# Altium project BLDC Gate Driver Breakout.PrjPcb
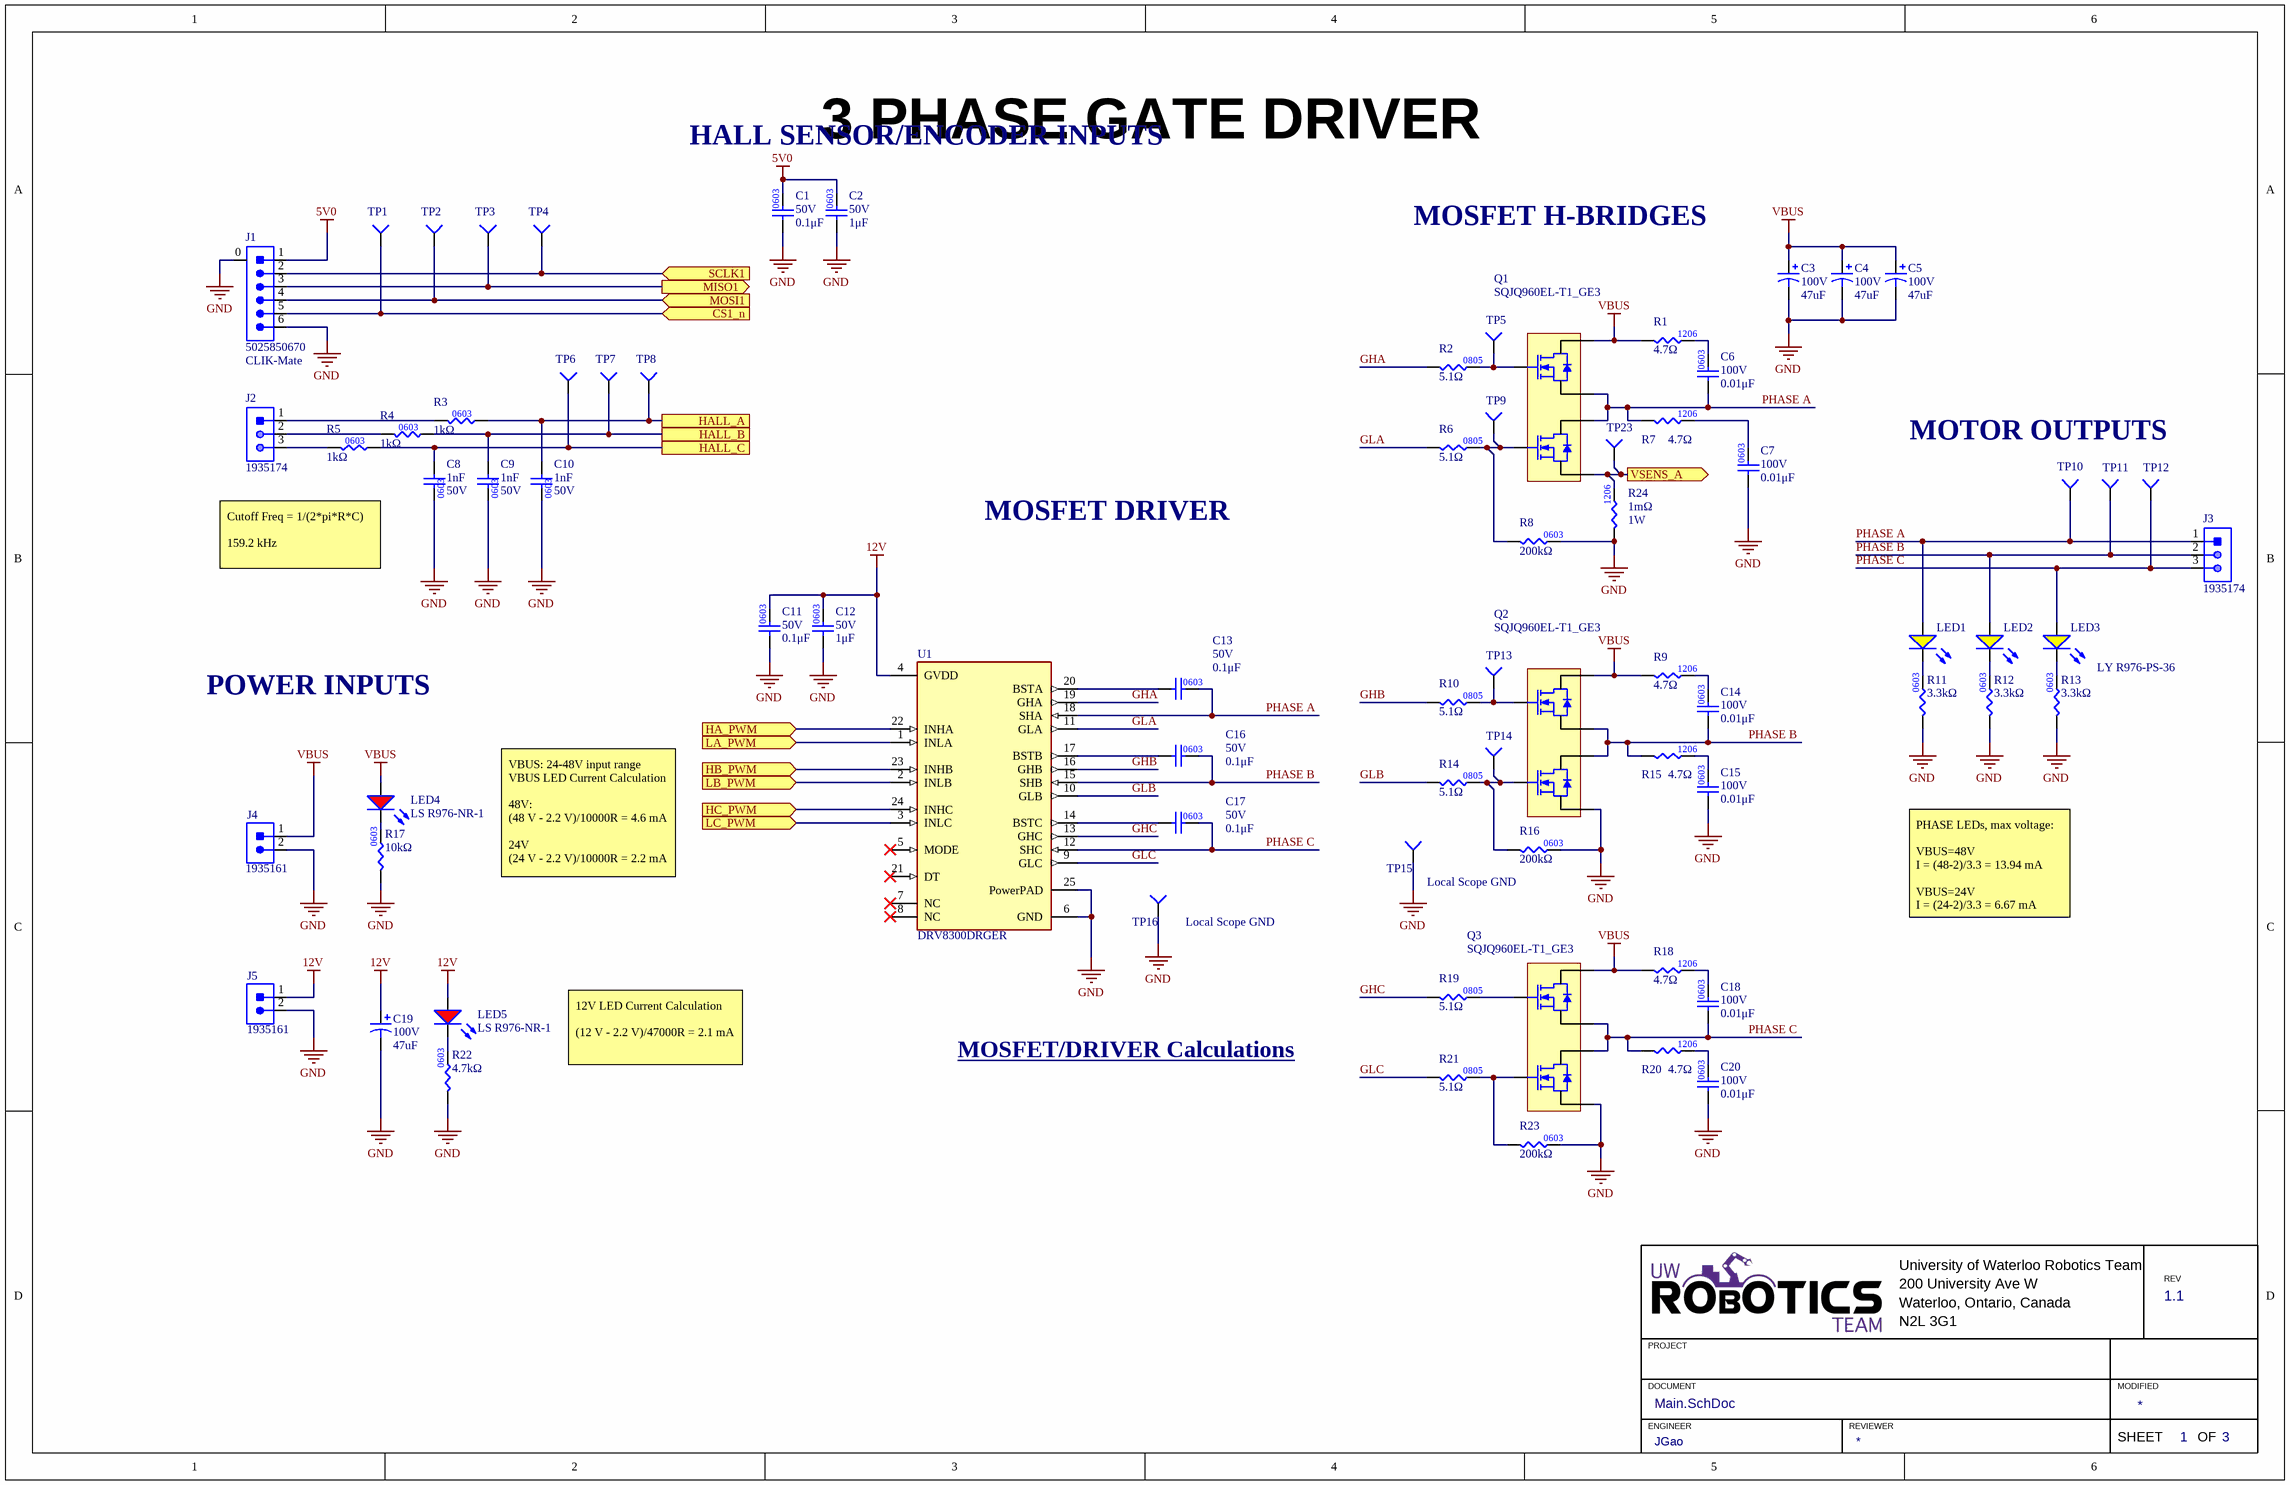
[diagram p0: Main.SchDoc]
3 sheets, 90 parts. Net scope: flat (ports and power ports of the same name join across sheets).
Board file: BLDC Gate Driver Breakout.PcbDoc
Sheets:
  Main.SchDoc
  MCU.SchDoc
  SENSE_AMP.SchDoc

## Sheet Main.SchDoc: 3 PHASE GATE DRIVER
size 431 x 279 mm; Date: 8/30/2021; Engineer: JGao; Revision: 1.1; SheetNumber: 1; SheetTotal: 3

### Parts
C1  value 0.1μF  Voltage Rating: 50V  [CAP0603]  (hidden comment: CAP_0.1uF_50V_0603)
C2  value 1μF  Voltage Rating: 50V  [CAP0603]  (hidden comment: CAP_1uF_50V_0603)
C3  Voltage Rating: 100V  Capacitance: 47uF  [RADIAL_CORNELL_D]  (hidden comment: CAP_47uF_100V_ALUM)
C4  Voltage Rating: 100V  Capacitance: 47uF  [RADIAL_CORNELL_D]  (hidden comment: CAP_47uF_100V_ALUM)
C5  Voltage Rating: 100V  Capacitance: 47uF  [RADIAL_CORNELL_D]  (hidden comment: CAP_47uF_100V_ALUM)
C6  value 0.01μF  Voltage Rating: 100V  [CAP0603]  (hidden comment: CAP_0.01uF_100V_0603)
C7  value 0.01μF  Voltage Rating: 100V  [CAP0603]  (hidden comment: CAP_0.01uF_100V_0603)
C8  value 1nF  Voltage Rating: 50V  [cap0603]  (hidden comment: CAP_1nF_50V_0603_XR7)
C9  value 1nF  Voltage Rating: 50V  [cap0603]  (hidden comment: CAP_1nF_50V_0603_XR7)
C10  value 1nF  Voltage Rating: 50V  [cap0603]  (hidden comment: CAP_1nF_50V_0603_XR7)
C11  value 0.1μF  Voltage Rating: 50V  [CAP0603]  (hidden comment: CAP_0.1uF_50V_0603)
C12  value 1μF  Voltage Rating: 50V  [CAP0603]  (hidden comment: CAP_1uF_50V_0603)
C13  value 0.1μF  Voltage Rating: 50V  [CAP0603]  (hidden comment: CAP_0.1uF_50V_0603)
C14  value 0.01μF  Voltage Rating: 100V  [CAP0603]  (hidden comment: CAP_0.01uF_100V_0603)
C15  value 0.01μF  Voltage Rating: 100V  [CAP0603]  (hidden comment: CAP_0.01uF_100V_0603)
C16  value 0.1μF  Voltage Rating: 50V  [CAP0603]  (hidden comment: CAP_0.1uF_50V_0603)
C17  value 0.1μF  Voltage Rating: 50V  [CAP0603]  (hidden comment: CAP_0.1uF_50V_0603)
C18  value 0.01μF  Voltage Rating: 100V  [CAP0603]  (hidden comment: CAP_0.01uF_100V_0603)
C19  Voltage Rating: 100V  Capacitance: 47uF  [RADIAL_CORNELL_D]  (hidden comment: CAP_47uF_100V_ALUM)
C20  value 0.01μF  Voltage Rating: 100V  [CAP0603]  (hidden comment: CAP_0.01uF_100V_0603)
J1  Manufacturer Part Number 1: 5025850670  Family: CLIK-Mate  [MOLEX-5025850670]  (hidden comment: CON_6M_SM_RA_1.5mm)
J2  CON_3POS_SCREW_TERM  [1935174]  (value not drawn)
J3  CON_3POS_SCREW_TERM  [1935174]  (value not drawn)
J4  CON_2POS_SCREW_TERM  [1935161]  (value not drawn)
J5  CON_2POS_SCREW_TERM  [1935161]  (value not drawn)
LED1  Manufacturer Part Number 1: LY R976-PS-36  [LED_0805_YELLOW]  (hidden comment: LED_YELLOW)
LED2  LED_YELLOW  [LED_0805_YELLOW]  (value not drawn)
LED3  LED_YELLOW  [LED_0805_YELLOW]  (value not drawn)
LED4  Manufacturer Part Number 1: LS R976-NR-1  [LED_0805_RED]  (hidden comment: LED_RED)
LED5  Manufacturer Part Number 1: LS R976-NR-1  [LED_0805_RED]  (hidden comment: LED_RED)
Q1  Manufacturer Part Number: SQJQ960EL-T1_GE3  [PowerPAK 8 x 8 Dual]  (hidden comment: NMOS_2CH_60V_63A)
Q2  Manufacturer Part Number: SQJQ960EL-T1_GE3  [PowerPAK 8 x 8 Dual]  (hidden comment: NMOS_2CH_60V_63A)
Q3  Manufacturer Part Number: SQJQ960EL-T1_GE3  [PowerPAK 8 x 8 Dual]  (hidden comment: NMOS_2CH_60V_63A)
R1  value 4.7Ω  [RES1206]  (hidden comment: RES_4.7Ω_1206_1%)
R2  value 5.1Ω  [RES0805]  (hidden comment: RES_5.1Ω_0805_5%)
R3  value 1kΩ  [RES0603]  (hidden comment: RES_1kΩ_0603_5%)
R4  value 1kΩ  [RES0603]  (hidden comment: RES_1kΩ_0603_5%)
R5  value 1kΩ  [RES0603]  (hidden comment: RES_1kΩ_0603_5%)
R6  value 5.1Ω  [RES0805]  (hidden comment: RES_5.1Ω_0805_5%)
R7  value 4.7Ω  [RES1206]  (hidden comment: RES_4.7Ω_1206_1%)
R8  value 200kΩ  [RES0603]  (hidden comment: RES_200kΩ_0603_5%)
R9  value 4.7Ω  [RES1206]  (hidden comment: RES_4.7Ω_1206_1%)
R10  value 5.1Ω  [RES0805]  (hidden comment: RES_5.1Ω_0805_5%)
R11  value 3.3kΩ  [RES0603]  (hidden comment: RES_3.3kΩ_0603_1%)
R12  value 3.3kΩ  [RES0603]  (hidden comment: RES_3.3kΩ_0603_1%)
R13  value 3.3kΩ  [RES0603]  (hidden comment: RES_3.3kΩ_0603_1%)
R14  value 5.1Ω  [RES0805]  (hidden comment: RES_5.1Ω_0805_5%)
R15  value 4.7Ω  [RES1206]  (hidden comment: RES_4.7Ω_1206_1%)
R16  value 200kΩ  [RES0603]  (hidden comment: RES_200kΩ_0603_5%)
R17  value 10kΩ  [RES0603]  (hidden comment: RES_10kΩ_0603_5%)
R18  value 4.7Ω  [RES1206]  (hidden comment: RES_4.7Ω_1206_1%)
R19  value 5.1Ω  [RES0805]  (hidden comment: RES_5.1Ω_0805_5%)
R20  value 4.7Ω  [RES1206]  (hidden comment: RES_4.7Ω_1206_1%)
R21  value 5.1Ω  [RES0805]  (hidden comment: RES_5.1Ω_0805_5%)
R22  value 4.7kΩ  [RES0603]  (hidden comment: RES_4.7kΩ_0603_5%)
R23  value 200kΩ  [RES0603]  (hidden comment: RES_200kΩ_0603_5%)
R24  value 1mΩ  [RESC160320X70-RL1632T4F-R001-FNH]  (hidden comment: RES_1mΩ_1206_1%)
TP1  TESTPOINT_1MM_CIRCLE  [TESTPOINT_CIRCLE_1MM]  (value not drawn)  (no BOM)
TP2  TESTPOINT_1MM_CIRCLE  [TESTPOINT_CIRCLE_1MM]  (value not drawn)  (no BOM)
TP3  TESTPOINT_1MM_CIRCLE  [TESTPOINT_CIRCLE_1MM]  (value not drawn)  (no BOM)
TP4  TESTPOINT_1MM_CIRCLE  [TESTPOINT_CIRCLE_1MM]  (value not drawn)  (no BOM)
TP5  TESTPOINT_1MM_CIRCLE  [TESTPOINT_CIRCLE_1MM]  (value not drawn)  (no BOM)
TP6  TESTPOINT_1MM_CIRCLE  [TESTPOINT_CIRCLE_1MM]  (value not drawn)  (no BOM)
TP7  TESTPOINT_1MM_CIRCLE  [TESTPOINT_CIRCLE_1MM]  (value not drawn)  (no BOM)
TP8  TESTPOINT_1MM_CIRCLE  [TESTPOINT_CIRCLE_1MM]  (value not drawn)  (no BOM)
TP9  TESTPOINT_1MM_CIRCLE  [TESTPOINT_CIRCLE_1MM]  (value not drawn)  (no BOM)
TP10  TESTPOINT_1MM_CIRCLE  [TESTPOINT_CIRCLE_1MM]  (value not drawn)  (no BOM)
TP11  TESTPOINT_1MM_CIRCLE  [TESTPOINT_CIRCLE_1MM]  (value not drawn)  (no BOM)
TP12  TESTPOINT_1MM_CIRCLE  [TESTPOINT_CIRCLE_1MM]  (value not drawn)  (no BOM)
TP13  TESTPOINT_1MM_CIRCLE  [TESTPOINT_CIRCLE_1MM]  (value not drawn)  (no BOM)
TP14  TESTPOINT_1MM_CIRCLE  [TESTPOINT_CIRCLE_1MM]  (value not drawn)  (no BOM)
TP15  TESTPOINT_SMD_LOOP  [S1751-46R]  (value not drawn)
TP16  TESTPOINT_SMD_LOOP  [S1751-46R]  (value not drawn)
TP23  TESTPOINT_1MM_CIRCLE  [TESTPOINT_CIRCLE_1MM]  (value not drawn)  (no BOM)
U1  DRV8300DRGER  [RGE0024B-IPC_B]

### Ports
CS1_n (in), HA_PWM (in), HALL_A, HALL_B, HALL_C, HB_PWM (in), HC_PWM (in), LA_PWM (in), LB_PWM (in), LC_PWM (in), MISO1 (out), MOSI1 (in), SCLK1 (in), VSENS_A (out)

### Nets
5V0: C1.2 C2.2 J1.1
12V: C11.2 C12.2 C19.1 J5.1 LED5.1(A) U1.4(GVDD)
GND: C1.1 C2.1 C3.2 C4.2 C5.2 C7.1 C8.1 C9.1 C10.1 C11.1 C12.1 C15.1 C19.2 C20.1 J1.0 J1.6 J4.2 J5.2 Q2.3(S2) Q3.3(S2) R8.2 R11.1 R12.1 R13.1 R16.2 R17.1 R22.1 R23.2 R24.1 TP15.1(=value) TP16.1(=value) U1.6(GND) U1.25(PowerPAD)
VBUS: C3.1 C4.1 C5.1 J4.1 LED4.1(A) Q1.5(D1) Q2.5(D1) Q3.5(D1) R1.1 R9.1 R18.1
GHA: R2.1 U1.19(GHA)
GHB: R10.1 U1.16(GHB)
GHC: R19.1 U1.13(GHC)
GLA: R6.1 U1.11(GLA)
GLB: R14.1 U1.10(GLB)
GLC: R21.1 U1.9(GLC)
PHASE A: C6.1 C13.2 J3.1 LED1.1(A) Q1.2(S1) Q1.6(D2) R7.1 TP10.1(=value) U1.18(SHA)
PHASE B: C14.1 C16.2 J3.2 LED2.1(A) Q2.2(S1) Q2.6(D2) R15.1 TP11.1(=value) U1.15(SHB)
PHASE C: C17.2 C18.1 J3.3 LED3.1(A) Q3.2(S1) Q3.6(D2) R20.1 TP12.1(=value) U1.12(SHC)
NetC6_2: C6.2 R1.2
NetC7_2: C7.2 R7.2
NetC8_2: C8.2 R5.1 TP6.1(=value) ; port HALL_C
NetC9_2: C9.2 R4.1 TP7.1(=value) ; port HALL_B
NetC10_2: C10.2 R3.1 TP8.1(=value) ; port HALL_A
NetC13_1: C13.1 U1.20(BSTA)
NetC14_2: C14.2 R9.2
NetC15_2: C15.2 R15.2
NetC16_1: C16.1 U1.17(BSTB)
NetC17_1: C17.1 U1.14(BSTC)
NetC18_2: C18.2 R18.2
NetC20_2: C20.2 R20.2
NetJ1_2: J1.2 TP4.1(=value) ; port SCLK1
NetJ1_3: J1.3 TP3.1(=value) ; port MISO1
NetJ1_4: J1.4 TP2.1(=value) ; port MOSI1
NetJ1_5: J1.5 TP1.1(=value) ; port CS1_n
NetJ2_1: J2.1 R3.2
NetJ2_2: J2.2 R4.2
NetJ2_3: J2.3 R5.2
NetLED1_2: LED1.2(K) R11.2
NetLED2_2: LED2.2(K) R12.2
NetLED3_2: LED3.2(K) R13.2
NetLED4_2: LED4.2(K) R17.2
NetLED5_2: LED5.2(K) R22.2
NetQ1_1: Q1.1(G1) R2.2 TP5.1(=value)
NetQ1_3: Q1.3(S2) R24.2 TP23.1(=value) ; port VSENS_A
NetQ1_4: Q1.4(G2) R6.2 R8.1 TP9.1(=value)
NetQ2_1: Q2.1(G1) R10.2 TP13.1(=value)
NetQ2_4: Q2.4(G2) R14.2 R16.1 TP14.1(=value)
NetQ3_1: Q3.1(G1) R19.2
NetQ3_4: Q3.4(G2) R21.2 R23.1
NetTP17_1: U1.24(INHC) ; port HC_PWM
NetTP18_1: U1.23(INHB) ; port HB_PWM
NetTP19_1: U1.22(INHA) ; port HA_PWM
NetTP20_1: U1.1(INLA) ; port LA_PWM
NetTP21_1: U1.2(INLB) ; port LB_PWM
NetTP22_1: U1.3(INLC) ; port LC_PWM

Not connected (* = marked no-connect by the designer): U1 5(MODE)* 7(NC)* 8(NC)* 21(DT)*

### Notes on the sheet
- HALL SENSOR/ENCODER INPUTS
- MOSFET H-BRIDGES
- MOTOR OUTPUTS
- Cutoff Freq = 1/(2*pi*R*C)
  159.2 kHz
- MOSFET DRIVER
- (near R24) 1W
- POWER INPUTS
- VBUS: 24-48V input range
  VBUS LED Current Calculation
  48V:
  (48 V - 2.2 V)/10000R = 4.6 mA
  24V
  (24 V - 2.2 V)/10000R = 2.2 mA
- Local Scope GND
- (near TP16) Local Scope GND
- PHASE LEDs, max voltage:
  VBUS=48V
  I = (48-2)/3.3 = 13.94 mA
  VBUS=24V
  I = (24-2)/3.3 = 6.67 mA
- 12V LED Current Calculation
  (12 V - 2.2 V)/47000R = 2.1 mA
- MOSFET/DRIVER Calculations <https://docs.google.com/spreadsheets/d/1NeRwhSkltxL5f2jw2SGi_mhW-_8-vE8IHJGJZ6BkiJA/edit?usp=sharing>
- University of Waterloo Robotics Team
- 200 University Ave W
- REV
- PROJECT
- Waterloo, Ontario, Canada
- N2L 3G1
- DOCUMENT
- ENGINEER
- REVIEWER
- MODIFIED
- SHEET
- OF
- (in symbol CAP_0.01uF_100V_0603) 0603
- (in symbol CAP_1uF_50V_0603) 0603
- (in symbol RES_4.7kΩ_0603_5%) 0603
- (in symbol RES_5.1Ω_0805_5%) 0805

### Library data of the parts
C1 C11 C13 C16 C17 = CAP_0.1uF_50V_0603: CAP CER 0.1UF 50V X7R 0603; Manufacturer Part Number 1: CC0603KRX7R9BB104; Manufacturer 1: Yageo; Package/Footprint: 0603; Supplier Part Number 1: 311-1344-1-ND; Supplier 1: Digi-Key; Mounting Type: SMD; Dielectric: X7R
C2 C12 = CAP_1uF_50V_0603: CAP CER 1UF 50V X6S 0603; Manufacturer Part Number 1: C1608X6S1H105K080AC; Manufacturer 1: TDK Corporation; Supplier Part Number 1: 445-7424-1-ND; Supplier 1: Digi-Key; Dielectric: X6S
C3-C5 C19 = CAP_47uF_100V_ALUM: Aluminum Electrolytic Capacitor, Polarized, Aluminum (wet), 100V, 20% +Tol, 20% -Tol, 47uF, Surface Mount, 5454; Manufacturer: Nichicon; Manufacturer Part Number: UCD2A470MNQ1MS; Dielectric Material: Aluminium; Leakage Current: 47uA; Ripple Current: 250mA; Tan Delta: 0.07; ComponentLink1URL: https://datasheet.ciiva.com:443/pdfs/VipMasterIC/IC/NICH/NICH-S-A0003527725/NICH-S-A0003527725-1.pdf?src-supplier=IHS+Markit; ComponentLink1Description: https://datasheet.ciiva.com:443/pdfs/VipMasterIC/IC/NICH/NICH-S-A0003527725/NICH-S-A0003527725-1.pdf?src-supplier=IHS+Markit; ComponentLink2URL: https://datasheet.ciiva.com/11776/0900766b80ebdadd-11776792.pdf?src-supplier=RSComponents; ComponentLink2Description: https://datasheet.ciiva.com/11776/0900766b80ebdadd-11776792.pdf?src-supplier=RSComponents; ComponentLink3URL: https://datasheet.ciiva.com/30526/getdatasheetpartid-513218-30526979.pdf?src-supplier=Verical; ComponentLink3Description: https://datasheet.ciiva.com/30526/getdatasheetpartid-513218-30526979.pdf?src-supplier=Verical; ComponentLink4URL: https://datasheet.ciiva.com/16389/e-cd-16389182.pdf?src-supplier=Future+Electronics; ComponentLink4Description: https://datasheet.ciiva.com/16389/e-cd-16389182.pdf?src-supplier=Future+Electronics; ComponentLink5URL: https://datasheet.ciiva.com/17523/e-cd-17523974.pdf?src-supplier=Avnet+Europe; ComponentLink5Description: https://datasheet.ciiva.com/17523/e-cd-17523974.pdf?src-supplier=Avnet+Europe; ComponentLink6URL: https://datasheet.ciiva.com/6326/e-cd-6326630.pdf?src-supplier=Digi-Key; ComponentLink6Description: https://datasheet.ciiva.com/6326/e-cd-6326630.pdf?src-supplier=Digi-Key; ComponentLink7URL: https://datasheet.ciiva.com/6326/e-cd-6326632.pdf?src-supplier=Digi-Key; ComponentLink7Description: https://datasheet.ciiva.com/6326/e-cd-6326632.pdf?src-supplier=Digi-Key; ComponentLink8URL: https://datasheet.ciiva.com/6326/e-cd-6326634.pdf?src-supplier=Digi-Key; ComponentLink8Description: https://datasheet.ciiva.com/6326/e-cd-6326634.pdf?src-supplier=Digi-Key; Supplier 1: Digi-Key; RoHS: Yes; Category: Aluminum Electrolytic Capacitors; Stock 1: 515; Pricing 1: 1=2.15000, 10=1.69800, 50=1.47140, 100=1.27330 (USD); Mount: Surface Mount; Number of Pins: 2; Package Shape: Cylindrical; Size Code: 7575; Terminal Finish: Copper; Min Operating Temperature: -55°C; Max Operating Temperature: 105°C; JESD-609 Code: e3; Polarity: Polarized; Capacitor Type: Aluminium; Negative Tolerance: 20%; Package Style: SMTMeter; Packaging: Tape and Reel; Positive Tolerance: 20%; Rated DC Voltage (URdc): 100V; Termination: Flat; Length: 14.6mm; Width: 13.6mm; Height: 13.5mm; REACH SVHC: Yes; RoHS Compliant: Yes; Supplier Part Number 1: 493-6201-1-ND
C6 C7 C14 C15 C18 C20 = CAP_0.01uF_100V_0603: CAP CER 0.01uF 100V X7R 0603; Manufacturer Part Number 1: GCM188R72A103KA37J; Manufacturer 1: Murata Electronics; Supplier Part Number 1: 490-8028-1-ND; Supplier 1: Digi-Key; Dielectric: X7R
C8-C10 = CAP_1nF_50V_0603_XR7: CAP CER 1NF 50V X7R 0603; Manufacturer: KYOCERA AVX; Manufacturer Part Number: 06035C102KAT2A; Dielectric: X7R; Package: 0603; Supplier 1: Digi-Key; Supplier Part Number 1: 478-1215-2-ND
J1 = CON_6M_SM_RA_1.5mm: CONN HEADER SMD RIGHT ANGLE 1.5 MM PITCH; Manufacturer 1: Molex; Supplier 1: Digi-Key; Supplier Part Number 1: WM12832CT-ND; Package/Footprint: SMD; Mounting Type: SMD
J2 J3 = CON_3POS_SCREW_TERM: TERM BLK 3POS SIDE ENTRY 5MM; Manufacturer 1: Phoenix Contact; Package/Footprint: TH; Voltage Rating: 250V; Current Rating: 17.5A; Supplier 1: Digi-Key; Mounting Type: TH; Orientation: Straight; Pitch: 5mm; Supplier Part Number 1: 277-1578-ND; Manufacturer Part Number 1: 1935174
J4 J5 = CON_2POS_SCREW_TERM: TERM BLK 2POS SIDE ENTRY 5MM; Manufacturer 1: Phoenix Contact; Package/Footprint: SMD; Supplier 1: Digi-Key; Mounting Type: TH; Supplier Part Number 1: 277-1667-ND; Manufacturer Part Number 1: 1935161
LED1 = LED_YELLOW: LED YELLOW DIFFUSED 0805 SMD; Manufacturer 1: OSRAM; Forward Voltage Drop: 2.2V; Package: 0805 (2012 Metric); Supplier Part Number 1: 475-2560-1-ND; Supplier 1: Digi-Key
LED2 LED3 = LED_YELLOW: LED YELLOW DIFFUSED 0805 SMD; Manufacturer 1: OSRAM; Manufacturer Part Number 1: LY R976-PS-36; Forward Voltage Drop: 2.2V; Package: 0805 (2012 Metric); Supplier Part Number 1: 475-2560-1-ND; Supplier 1: Digi-Key
LED4 LED5 = LED_RED: LED RED DIFFUSED 0805 SMD; Manufacturer 1: OSRAM; Package/Footprint: 0805; Forward Voltage Drop: 2V; Supplier Part Number 1: 475-1278-1-ND; Supplier 1: Digi-Key; Mounting Type: SMD
Q1-Q3 = NMOS_2CH_60V_63A: MOSFET 2 N-CH 60V POWERPAK8X8; Manufacturer: Vishay; Supplier 1: Digi-Key; RoHS: No; Category: MOSFETs; Stock 1: 848; Pricing 1: 1=2.32000, 10=2.08400, 100=1.67520, 500=1.37638, 1000=1.17975 (USD); ComponentLink1URL: http://www.vishay.com/docs/76020/sqjq960el.pdf?src-supplier=Digi-Key; ComponentLink1Description: http://www.vishay.com/docs/76020/sqjq960el.pdf?src-supplier=Digi-Key; Supplier Part Number 1: SQJQ960EL-T1_GE3CT-ND
R1 R7 R9 R15 R18 R20 = RES_4.7Ω_1206_1%: RES 4.7 OHM 1% 1/2W 1206; Manufacturer 1: Stackpole Electronics Inc; Manufacturer Part Number 1: RNCP1206FTD4R70; Package/Footprint: 1206; Mounting Type: SMD; Supplier 1: Digi-Key; Supplier Part Number 1: RNCP1206FTD4R70CT-ND
R2 R6 R10 R14 R19 R21 = RES_5.1Ω_0805_5%: RES 5.1 OHM 5% 1/8W 0805; Manufacturer 1: Panasonic; Manufacturer Part Number 1: ERJ-6GEYJ5R1V; Supplier 1: Digi-Key; Supplier Part Number 1: P5.1ACT-ND
R3-R5 = RES_1kΩ_0603_5%: RES 1K OHM 5% 1/10W 0603; Manufacturer 1: Yageo; Manufacturer Part Number 1: RC0603JR-071KL; Supplier Part Number 1: 311-1.0KGRCT-ND; Supplier 1: Digi-Key; Mounting Type: SMD; Package: 0603
R8 R16 R23 = RES_200kΩ_0603_5%: RES 200K OHM 5% 1/10W 0603; Manufacturer 1: Panasonic Electronic Components; Manufacturer Part Number 1: ERJ-3GEYJ204V; Package/Footprint: 0603; Supplier Part Number 1: P200KGCT-ND; Supplier 1: Digi-Key; Mounting Type: SMD
R11-R13 = RES_3.3kΩ_0603_1%: RES 3.3K OHM 1% 1/10W 0603; Manufacturer 1: Yageo; Manufacturer Part Number 1: RT0603FRE073K3L; Supplier 1: Digi-Key; Supplier Part Number 1: YAG3354CT-ND; Mounting Type: SMD; Package: 0603
R17 = RES_10kΩ_0603_5%: RES 10K OHM 5% 1/10W 0603; Manufacturer 1: Yageo; Manufacturer Part Number 1: RC0603JR-0710KL; Supplier Part Number 1: 311-10KGRCT-ND; Supplier 1: Digi-Key; Mounting Type: SMD; Package: 0603
R22 = RES_4.7kΩ_0603_5%: RES 4.7K OHM 5% 1/10W 0603; Manufacturer 1: Yageo; Manufacturer Part Number 1: RC0603JR-074K7L; Supplier Part Number 1: 311-4.7KGRCT-ND; Supplier 1: Digi-Key
R24 = RES_1mΩ_1206_1%: RES 0.001 OHM 1% 1W 1206; Manufacturer 1: Delta Electronics/Cyntec; Manufacturer Part Number 1: RL1632T4F-R001-FNH; Package/Footprint: 1206; Mounting Type: SMD; Supplier 1: Digi-Key; Supplier Part Number 1: 2037-RL1632T4F-R001-FNHCT-ND
TP1-TP14 TP23 = TESTPOINT_1MM_CIRCLE: TESTPOINT 1MM CIRCLE
TP15 TP16 = TESTPOINT_SMD_LOOP: TESTPOINT SMD LOOP; Manufacturer 1: Harwin; Supplier 1: Digi-Key; Manufacturer Part Number 1: S1751-46R; Mounting Type: SMD; Package/Footprint: SMD; Supplier Part Number 1: 952-1478-1-ND
U1 = DRV8300DRGER: High-Side and Low-Side Gate Driver IC Non-Inverting 24-VQFN (4x4); Mfr_Name: Texas Instruments; Type: DEV; RefDes: RefDes; Copyright: Copyright (C) 2022 Ultra Librarian. All rights reserved.; Manufacturer_Part_Number: DRV8300DRGER; Supplier 1: Digi-Key; Supplier Part Number 1: 296-DRV8300DRGERCT-ND

## Sheet MCU.SchDoc: MCU
size 279 x 215 mm; Engineer: JGao; Revision: 1.1; SheetNumber: 2; SheetTotal: 3
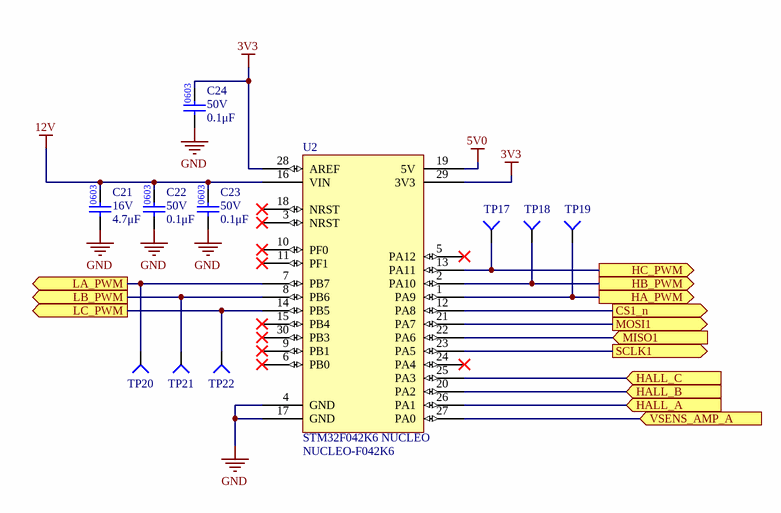
[diagram p1: MCU.SchDoc]

### Parts
C21  value 4.7μF  Voltage Rating: 16V  [CAP0603]  (hidden comment: CAP_4.7uF_16V_0603)
C22  value 0.1μF  Voltage Rating: 50V  [CAP0603]  (hidden comment: CAP_0.1uF_50V_0603)
C23  value 0.1μF  Voltage Rating: 50V  [CAP0603]  (hidden comment: CAP_0.1uF_50V_0603)
C24  value 0.1μF  Voltage Rating: 50V  [CAP0603]  (hidden comment: CAP_0.1uF_50V_0603)
TP17  TESTPOINT_1MM_CIRCLE  [TESTPOINT_CIRCLE_1MM]  (value not drawn)  (no BOM)
TP18  TESTPOINT_1MM_CIRCLE  [TESTPOINT_CIRCLE_1MM]  (value not drawn)  (no BOM)
TP19  TESTPOINT_1MM_CIRCLE  [TESTPOINT_CIRCLE_1MM]  (value not drawn)  (no BOM)
TP20  TESTPOINT_1MM_CIRCLE  [TESTPOINT_CIRCLE_1MM]  (value not drawn)  (no BOM)
TP21  TESTPOINT_1MM_CIRCLE  [TESTPOINT_CIRCLE_1MM]  (value not drawn)  (no BOM)
TP22  TESTPOINT_1MM_CIRCLE  [TESTPOINT_CIRCLE_1MM]  (value not drawn)  (no BOM)
U2  STM32F042K6 NUCLEO  [NUCLEO-F042K6]

### Ports
CS1_n (out), HA_PWM (out), HALL_A (in), HALL_B (in), HALL_C (in), HB_PWM (out), HC_PWM (out), LA_PWM (out), LB_PWM (out), LC_PWM (out), MISO1 (in), MOSI1 (out), SCLK1 (out), VSENS_AMP_A (in)

### Nets
3V3: C24.2 U2.28(AREF) U2.29(3V3)
5V0: U2.19(5V)
12V: C21.2 C22.2 C23.2 U2.16(VIN)
GND: C21.1 C22.1 C23.1 C24.1 U2.4(GND) U2.17(GND)
NetC8_2: U2.25(PA3) ; port HALL_C
NetC9_2: U2.20(PA2) ; port HALL_B
NetC10_2: U2.26(PA1) ; port HALL_A
NetJ1_2: U2.23(PA5) ; port SCLK1
NetJ1_3: U2.22(PA6) ; port MISO1
NetJ1_4: U2.21(PA7) ; port MOSI1
NetJ1_5: U2.12(PA8) ; port CS1_n
NetR25_2: U2.27(PA0) ; port VSENS_AMP_A
NetTP17_1: TP17.1(=value) U2.13(PA11) ; port HC_PWM
NetTP18_1: TP18.1(=value) U2.2(PA10) ; port HB_PWM
NetTP19_1: TP19.1(=value) U2.1(PA9) ; port HA_PWM
NetTP20_1: TP20.1(=value) U2.7(PB7) ; port LA_PWM
NetTP21_1: TP21.1(=value) U2.8(PB6) ; port LB_PWM
NetTP22_1: TP22.1(=value) U2.14(PB5) ; port LC_PWM

Not connected (* = marked no-connect by the designer): U2 3(NRST)* 5(PA12)* 6(PB0)* 9(PB1)* 10(PF0)* 11(PF1)* 15(PB4)* 18(NRST)* 24(PA4)* 30(PB3)*

### Notes on the sheet
- University of Waterloo Robotics Team
- 200 University Ave W
- REV
- PROJECT
- Waterloo, Ontario, Canada
- N2L 3G1
- DOCUMENT
- ENGINEER
- REVIEWER
- MODIFIED
- SHEET
- OF

### Library data of the parts
C21 = CAP_4.7uF_16V_0603: CAP CER 4.7UF 16V X6S 0603; Manufacturer Part Number 1: GRM188C81C475KE11D; Manufacturer 1: Murata Electronics; Supplier Part Number 1: 490-13362-1-ND; Supplier 1: Digi-Key; Mounting Type: SMD; Package: 0603; Dielectric: X6S
C22-C24 = CAP_0.1uF_50V_0603: as C1 on sheet Main; Supplier Part Number 1: 311-1344-1-ND; Supplier 1: Digi-Key; Mounting Type: SMD; Dielectric: X7R
TP17-TP22 = TESTPOINT_1MM_CIRCLE: TESTPOINT 1MM CIRCLE
U2 = STM32F042K6-NUCLEO: STM32 Nucleo-32 development board with STM32F042K6 MCU, supports Arduino connectivity; Manufacturer: STMicroelectronics; Supplier 1: Digi-Key; RoHS: Yes; Category: Embedded Processors and Controllers; Stock 1: 10; Pricing 1: 1=10.99000 (USD); ComponentLink1URL: http://www.farnell.com/datasheets/1966773.pdf?src-supplier=Farnell; ComponentLink1Description: http://www.farnell.com/datasheets/1966773.pdf?src-supplier=Farnell; ComponentLink2URL: http://www.st.com/content/ccc/resource/technical/document/data_brief/b1/d8/13/d4/b0/b7/4b/6e/DM00214578.pdf/files/DM00214578.pdf/jcr:content/translations/en.DM00214578.pdf?src-supplier=Digi-Key; ComponentLink2Description: http://www.st.com/content/ccc/resource/technical/document/data_brief/b1/d8/13/d4/b0/b7/4b/6e/DM00214578.pdf/files/DM00214578.pdf/jcr:content/translations/en.DM00214578.pdf?src-supplier=Digi-Key; ComponentLink3URL: http://www.st.com/st-web-ui/static/active/en/resource/technical/document/user_manual/DM00119724.pdf?s_searchtype=keyword&src-supplier=Avnet; ComponentLink3Description: http://www.st.com/st-web-ui/static/active/en/resource/technical/document/user_manual/DM00119724.pdf?s_searchtype=keyword&src-supplier=Avnet; ComponentLink4URL: http://www.farnell.com/datasheets/1966773.pdf?src-supplier=Element14; ComponentLink4Description: http://www.farnell.com/datasheets/1966773.pdf?src-supplier=Element14; ComponentLink5URL: http://www.st.com/st-web-ui/static/active/en/resource/technical/document/user_manual/DM00119724.pdf?s_searchtype=keyword&src-supplier=Avnet+Asia; ComponentLink5Description: http://www.st.com/st-web-ui/static/active/en/resource/technical/document/user_manual/DM00119724.pdf?s_searchtype=keyword&src-supplier=Avnet+Asia; Supplier Part Number 1: 497-15980-ND; Manufacturer Part Number: NUCLEO-F042K6

## Sheet SENSE_AMP.SchDoc: Current Sense Amplification
size 431 x 279 mm; Engineer: JGao; Organization: TESLA Motors, INC; Address1: 3500 Deer Creek Road; Address2: Palo Alto, CA; Address4: U.S.A.; Revision: 1.1; SheetNumber: 3; SheetTotal: 3
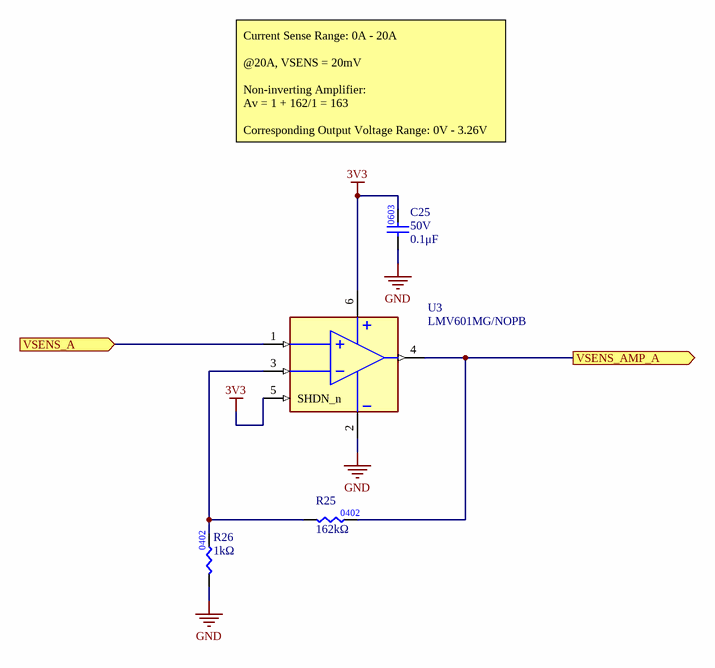
[diagram p2: SENSE_AMP.SchDoc]

### Parts
C25  value 0.1μF  Voltage Rating: 50V  [CAP0603]  (hidden comment: CAP_0.1uF_50V_0603)
R25  value 162kΩ  [RES0402]  (hidden comment: RES_162kΩ_0402_1%)
R26  value 1kΩ  [RES0402]  (hidden comment: RES_1kΩ_0402_1%)
U3  LMV601MG/NOPB  [SOT65P210X110-6N]

### Ports
VSENS_A (in), VSENS_AMP_A (out)

### Nets
3V3: C25.2 U3.5(SHDN_n) U3.6(V+)
GND: C25.1 R26.1 U3.2(GND)
NetQ1_3: U3.1(IN+) ; port VSENS_A
NetR25_1: R25.1 R26.2 U3.3(IN-)
NetR25_2: R25.2 U3.4(OUT) ; port VSENS_AMP_A

### Notes on the sheet
- Current Sense Range: 0A - 20A
  @20A, VSENS = 20mV
  Non-inverting Amplifier:
  Av = 1 + 162/1 = 163
  Corresponding Output Voltage Range: 0V - 3.26V
- University of Waterloo Robotics Team
- 200 University Ave W
- REV
- PROJECT
- Waterloo, Ontario, Canada
- N2L 3G1
- DOCUMENT
- ENGINEER
- REVIEWER
- MODIFIED
- SHEET
- OF

### Library data of the parts
C25 = CAP_0.1uF_50V_0603: as C1 on sheet Main; Supplier Part Number 1: 311-1344-1-ND; Supplier 1: Digi-Key; Mounting Type: SMD; Dielectric: X7R
R25 = RES_162kΩ_0402_1%: RES 162K OHM 1% 1/16W 0402; Manufacturer Part Number 1: RMCF0402FT162K; Manufacturer 1: Panasonic Electronic Components; Power: 0.063W, 1/16W; Package/Footprint: 0402; Supplier 1: Digi-Key; Supplier Part Number 1: RMCF0402FT162KCT-ND; Mounting Type: SMD; Tolerance: 1%
R26 = RES_1kΩ_0402_1%: RES 1K OHM 1% 1/16W 0402; Manufacturer 1: Stackpole Electronics; Manufacturer Part Number 1: RMCF0402FT1K00; Supplier 1: Digi-Key; Supplier Part Number 1: RMCF0402FT1K00CT-ND; Tolerance: 1%; Package: 0402
U3 = IC_OPAMP_GP: IC OPAMP GP 1 CIRCUIT SC70-6; Manufacturer: Texas Instruments; Ratings: 2.7-5.5V, -25-125degC, 1MHz; Manufacturer Part Number: LMV601MG/NOPB; Value: LMV601MG/NOPB

## Nets that join several sheets
3V3: MCU (C24.2 U2.28 U2.29), SENSE_AMP (C25.2 U3.5 U3.6)
5V0: Main (C1.2 C2.2 J1.1), MCU (U2.19)
12V: Main (6 pins), MCU (C21.2 C22.2 C23.2 U2.16)
GND: Main (33 pins), MCU (6 pins), SENSE_AMP (C25.1 R26.1 U3.2)
NetC8_2: Main (C8.2 R5.1 TP6.1), MCU (U2.25)
NetC9_2: Main (C9.2 R4.1 TP7.1), MCU (U2.20)
NetC10_2: Main (C10.2 R3.1 TP8.1), MCU (U2.26)
NetJ1_2: Main (J1.2 TP4.1), MCU (U2.23)
NetJ1_3: Main (J1.3 TP3.1), MCU (U2.22)
NetJ1_4: Main (J1.4 TP2.1), MCU (U2.21)
NetJ1_5: Main (J1.5 TP1.1), MCU (U2.12)
NetQ1_3: Main (Q1.3 R24.2 TP23.1), SENSE_AMP (U3.1)
NetR25_2: MCU (U2.27), SENSE_AMP (R25.2 U3.4)
NetTP17_1: Main (U1.24), MCU (TP17.1 U2.13)
NetTP18_1: Main (U1.23), MCU (TP18.1 U2.2)
NetTP19_1: Main (U1.22), MCU (TP19.1 U2.1)
NetTP20_1: Main (U1.1), MCU (TP20.1 U2.7)
NetTP21_1: Main (U1.2), MCU (TP21.1 U2.8)
NetTP22_1: Main (U1.3), MCU (TP22.1 U2.14)